# EAGLE design digits (EAGLE 7.7.0)
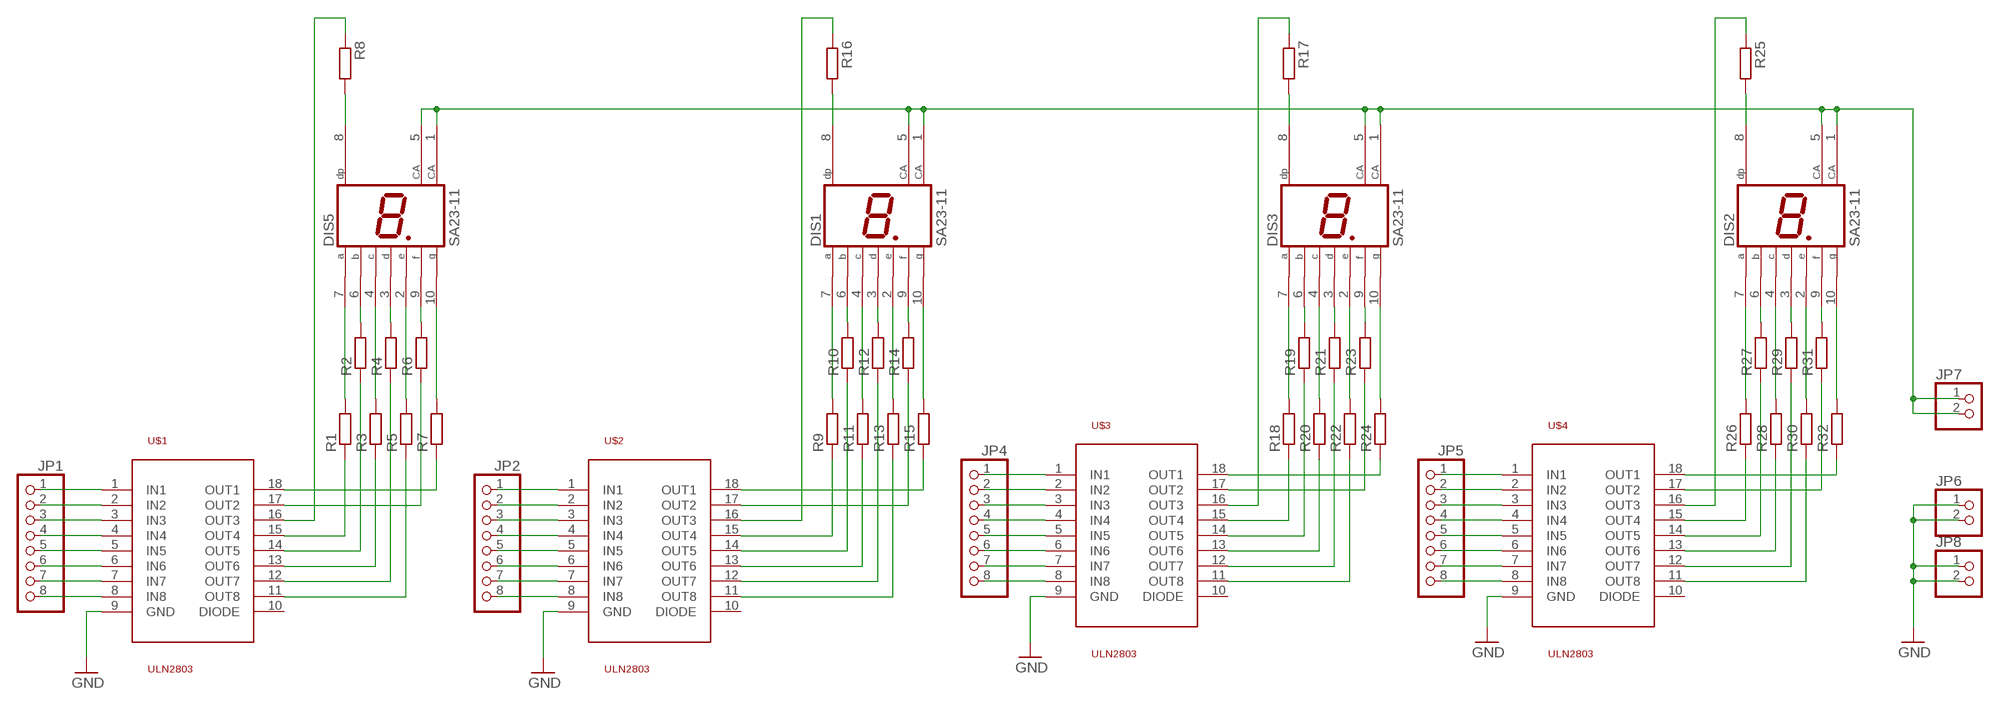
[diagram p0: schematic, sheet 1]

## Parts
DIS1  SA23-11  [SX23-XX]
DIS2  SA23-11  [SX23-XX]
DIS3  SA23-11  [SX23-XX]
DIS5  SA23-11  [SX23-XX]
JP1  PINHD-1X8  [1X08]
JP2  PINHD-1X8  [1X08]
JP4  PINHD-1X8  [1X08]
JP5  PINHD-1X8  [1X08]
JP6  PINHD-1X2  [1X02]
JP7  PINHD-1X2  [1X02]
JP8  PINHD-1X2  [1X02]
R1  R-EU_R0603  [R0603]
R2  R-EU_R0603  [R0603]
R3  R-EU_0204/7  [0204/7]
R4  R-EU_0204/7  [0204/7]
R5  R-EU_0204/7  [0204/7]
R6  R-EU_R0603  [R0603]
R7  R-EU_R0603  [R0603]
R8  R-EU_R0603  [R0603]
R9  R-EU_R0603  [R0603]
R10  R-EU_R0603  [R0603]
R11  R-EU_0204/7  [0204/7]
R12  R-EU_0204/7  [0204/7]
R13  R-EU_0204/7  [0204/7]
R14  R-EU_R0603  [R0603]
R15  R-EU_R0603  [R0603]
R16  R-EU_R0603  [R0603]
R17  R-EU_R0603  [R0603]
R18  R-EU_R0603  [R0603]
R19  R-EU_R0603  [R0603]
R20  R-EU_0204/7  [0204/7]
R21  R-EU_0204/7  [0204/7]
R22  R-EU_0204/7  [0204/7]
R23  R-EU_R0603  [R0603]
R24  R-EU_R0603  [R0603]
R25  R-EU_R0603  [R0603]
R26  R-EU_R0603  [R0603]
R27  R-EU_R0603  [R0603]
R28  R-EU_0204/7  [0204/7]
R29  R-EU_0204/7  [0204/7]
R30  R-EU_0204/7  [0204/7]
R31  R-EU_R0603  [R0603]
R32  R-EU_R0603  [R0603]
U$1  ULN2803  [SO18L]
U$2  ULN2803  [SO18L]
U$3  ULN2803  [SO18L]
U$4  ULN2803  [SO18L]

## Nets
9V: DIS1.1(CA) DIS1.5(CA) DIS2.1(CA) DIS2.5(CA) DIS3.1(CA) DIS3.5(CA) DIS5.1(CA) DIS5.5(CA) JP7.1 JP7.2
GND: JP6.1 JP6.2 JP8.1 JP8.2 U$1.9(GND) U$2.9(GND) U$3.9(GND) U$4.9(GND)
N$1: DIS5.7(A) R1.2
N$2: DIS5.6(B) R2.2
N$3: JP1.8 U$1.8(IN8)
N$4: JP1.7 U$1.7(IN7)
N$5: JP1.6 U$1.6(IN6)
N$6: JP1.1 U$1.1(IN1)
N$7: JP1.2 U$1.2(IN2)
N$8: JP1.3 U$1.3(IN3)
N$9: JP1.4 U$1.4(IN4)
N$10: JP1.5 U$1.5(IN5)
N$11: DIS5.4(C) R3.2
N$12: DIS5.3(D) R4.2
N$13: DIS5.2(E) R5.2
N$14: DIS5.9(F) R6.2
N$15: DIS5.10(G) R7.2
N$16: DIS5.8(DP) R8.2
N$17: DIS1.7(A) R9.2
N$18: DIS1.4(C) R11.2
N$19: DIS1.2(E) R13.2
N$20: DIS1.10(G) R15.2
N$21: DIS1.6(B) R10.2
N$22: DIS1.3(D) R12.2
N$23: DIS1.9(F) R14.2
N$24: DIS1.8(DP) R16.2
N$25: DIS3.8(DP) R17.2
N$26: DIS3.7(A) R18.2
N$27: DIS3.4(C) R20.2
N$28: JP2.3 U$2.3(IN3)
N$29: JP2.2 U$2.2(IN2)
N$30: JP2.1 U$2.1(IN1)
N$31: JP2.4 U$2.4(IN4)
N$32: JP2.5 U$2.5(IN5)
N$33: JP2.6 U$2.6(IN6)
N$34: JP2.7 U$2.7(IN7)
N$35: JP2.8 U$2.8(IN8)
N$36: JP4.1 U$3.1(IN1)
N$37: DIS3.2(E) R22.2
N$38: JP4.2 U$3.2(IN2)
N$39: JP4.3 U$3.3(IN3)
N$40: DIS3.10(G) R24.2
N$41: DIS3.6(B) R19.2
N$42: DIS3.3(D) R21.2
N$43: DIS3.9(F) R23.2
N$44: DIS2.8(DP) R25.2
N$45: DIS2.7(A) R26.2
N$46: DIS2.4(C) R28.2
N$47: DIS2.2(E) R30.2
N$48: JP4.4 U$3.4(IN4)
N$49: JP4.5 U$3.5(IN5)
N$50: JP4.6 U$3.6(IN6)
N$51: JP4.7 U$3.7(IN7)
N$52: JP4.8 U$3.8(IN8)
N$53: DIS2.10(G) R32.2
N$54: DIS2.6(B) R27.2
N$55: DIS2.3(D) R29.2
N$56: DIS2.9(F) R31.2
N$57: R5.1 U$1.11(OUT8)
N$58: R4.1 U$1.12(OUT7)
N$59: R3.1 U$1.13(OUT6)
N$60: R2.1 U$1.14(OUT5)
N$61: JP5.3 U$4.3(IN3)
N$62: JP5.1 U$4.1(IN1)
N$63: JP5.2 U$4.2(IN2)
N$64: JP5.4 U$4.4(IN4)
N$65: JP5.5 U$4.5(IN5)
N$66: JP5.6 U$4.6(IN6)
N$67: JP5.7 U$4.7(IN7)
N$68: JP5.8 U$4.8(IN8)
N$69: R1.1 U$1.15(OUT4)
N$70: R8.1 U$1.16(OUT3)
N$71: R6.1 U$1.17(OUT2)
N$72: R7.1 U$1.18(OUT1)
N$73: R15.1 U$2.18(OUT1)
N$74: R14.1 U$2.17(OUT2)
N$75: R16.1 U$2.16(OUT3)
N$76: R9.1 U$2.15(OUT4)
N$77: R10.1 U$2.14(OUT5)
N$78: R11.1 U$2.13(OUT6)
N$79: R12.1 U$2.12(OUT7)
N$80: R13.1 U$2.11(OUT8)
N$81: R24.1 U$3.18(OUT1)
N$82: R23.1 U$3.17(OUT2)
N$83: R17.1 U$3.16(OUT3)
N$84: R18.1 U$3.15(OUT4)
N$85: R19.1 U$3.14(OUT5)
N$86: R20.1 U$3.13(OUT6)
N$87: R21.1 U$3.12(OUT7)
N$88: R22.1 U$3.11(OUT8)
N$89: R32.1 U$4.18(OUT1)
N$90: R31.1 U$4.17(OUT2)
N$91: R25.1 U$4.16(OUT3)
N$92: R26.1 U$4.15(OUT4)
N$93: R27.1 U$4.14(OUT5)
N$94: R28.1 U$4.13(OUT6)
N$95: R29.1 U$4.12(OUT7)
N$96: R30.1 U$4.11(OUT8)
Unconnected: U$1.10(DIODE) U$2.10(DIODE) U$3.10(DIODE) U$4.10(DIODE)

## Library data of the parts
DIS1-DIS3 DIS5 = display-kingbright:SA23-11: LED DISPLAY 1-character 7 segment, decimal point right
JP1 JP2 JP4 JP5 = pinhead:PINHD-1X8: PIN HEADER
JP6-JP8 = pinhead:PINHD-1X2: PIN HEADER
R1-R32 = rcl:R-EU_: RESISTOR, European symbol
U$1-U$4 = uln2803:ULN2803

## Board
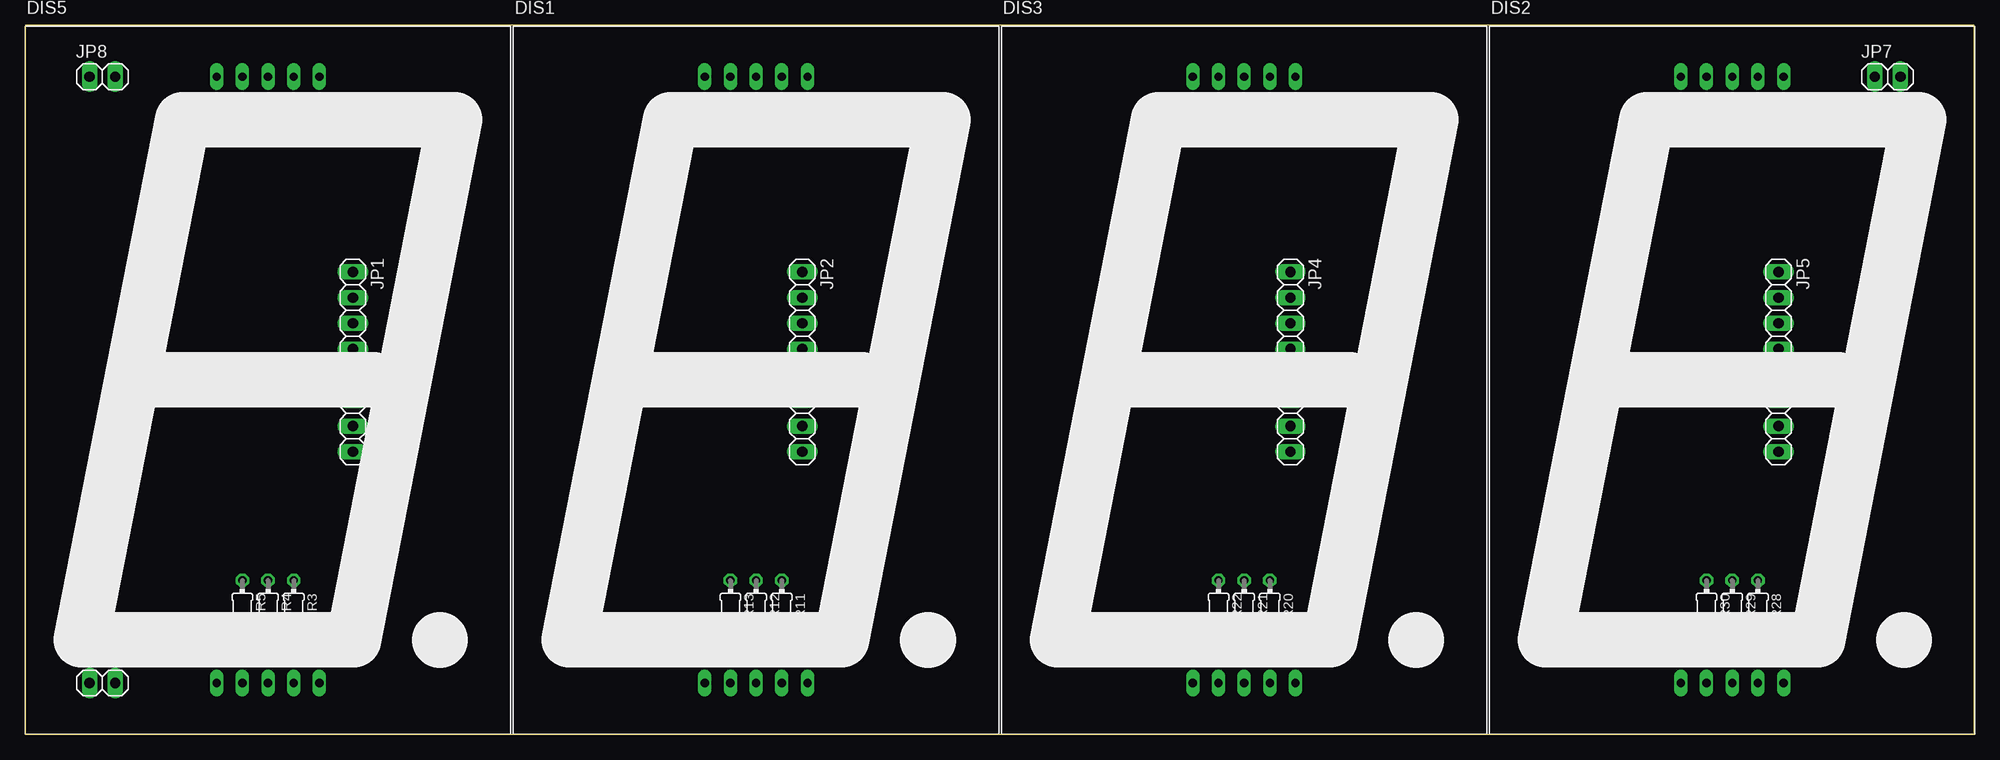
[diagram p1: board, top side]
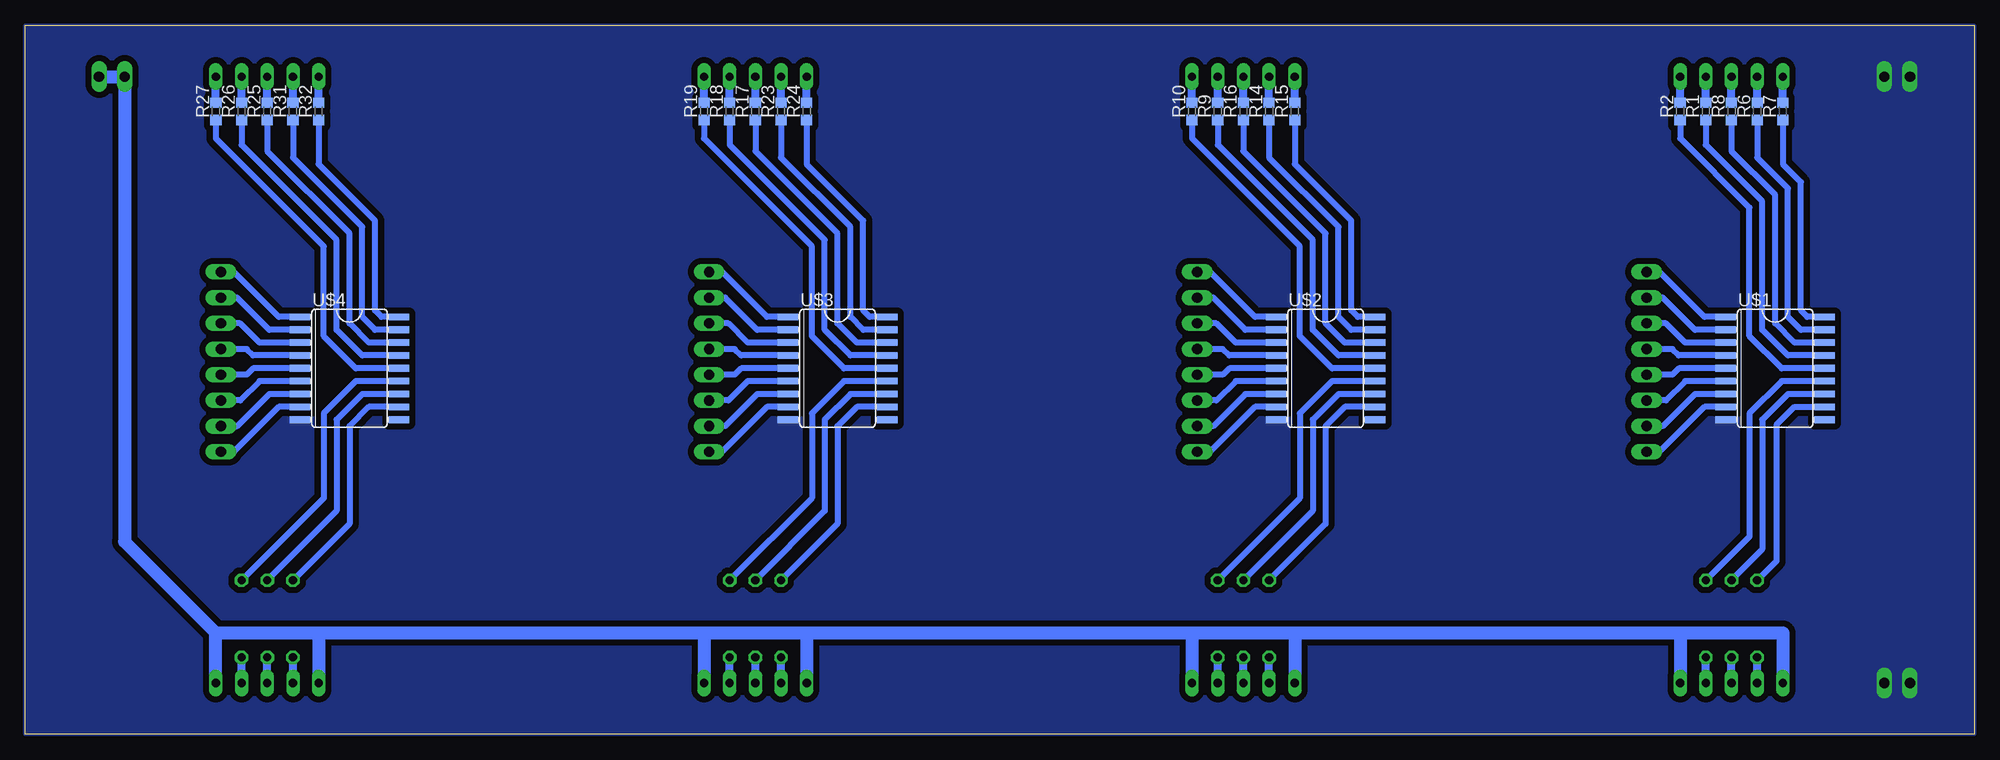
[diagram p2: board, bottom side, seen from below]

Size 192.71 x 70.1 mm. Coordinates in mm from the lower left corner, seen from the top.
Outline: 0,0 192.71,0 192.71,70.1 0,70.1 0,0
Copper layers (1*16): Top 0.035mm / dielectric 1.5mm / Bottom 0.035mm
Design rules "default *": minimum track width 10mil, minimum drill 24mil, track to track 8mil, track to pad 8mil, pad to pad 8mil, via to via 8mil, smd to smd 8mil, copper to edge 0mil, drill to drill 8mil, minimum pad ring 10mil, minimum via ring 8mil, stop-mask expansion 4mil, vias tented up to drill 0mil, thermal gap 10mil

### Footprints (pad centres in the part's own frame; a part is rotated, then mirrored left to right if it is on the bottom)
SX23-XX = drill 0.813 long: 1 18.923,5.08; 2 21.463,5.08; 3 24.003,5.08; 4 26.543,5.08; 5 29.083,5.08; 6 29.083,65.024; 7 26.543,65.024; 8 24.003,65.024; 9 21.463,65.024; 10 18.923,65.024
1X08 = drill 1.016 long: 1 -8.89,0; 2 -6.35,0; 3 -3.81,0; 4 -1.27,0; 5 1.27,0; 6 3.81,0; 7 6.35,0; 8 8.89,0
1X02 = drill 1.016 long: 1 -1.27,0; 2 1.27,0
R0603 = smd 1 x 1.1: 1 -0.85,0; 2 0.85,0
0204/7 = drill 0.813 octagon: 1 -3.81,0; 2 3.81,0
SO18L = smd 0.66 x 2.032: 1 -5.08,-4.902; 2 -3.81,-4.902; 3 -2.54,-4.902; 4 -1.27,-4.902; 5 0,-4.902; 6 1.27,-4.902; 7 2.54,-4.902; 8 3.81,-4.902; 9 5.08,-4.902; 10 5.08,4.902; 11 3.81,4.902; 12 2.54,4.902; 13 1.27,4.902; 14 0,4.902; 15 -1.27,4.902; 16 -2.54,4.902; 17 -3.81,4.902; 18 -5.08,4.902

### Placement (x,y rotation side)
DIS1  48.26,0 0 top
DIS2  144.78,0 0 top
DIS3  96.52,0 0 top
DIS5  0,0 0 top
JP1  32.38,36.83 270 top
JP2  76.83,36.83 270 top
JP4  125.09,36.83 270 top
JP5  173.35,36.83 270 top
JP6  7.62,5.08 0 top
JP7  184.15,65.02 0 top
JP8  7.62,65.02 0 top
R1  26.54,61.59 90 bottom
R2  29.08,61.59 90 bottom
R3  26.54,11.43 270 top
R4  24,11.43 270 top
R5  21.46,11.43 270 top
R6  21.46,61.59 90 bottom
R7  18.92,61.59 90 bottom
R8  24,61.59 90 bottom
R9  74.8,61.59 90 bottom
R10  77.34,61.59 90 bottom
R11  74.8,11.43 270 top
R12  72.26,11.43 270 top
R13  69.72,11.43 270 top
R14  69.72,61.59 90 bottom
R15  67.18,61.59 90 bottom
R16  72.26,61.59 90 bottom
R17  120.52,61.59 90 bottom
R18  123.06,61.59 90 bottom
R19  125.6,61.59 90 bottom
R20  123.06,11.43 270 top
R21  120.52,11.43 270 top
R22  117.98,11.43 270 top
R23  117.98,61.59 90 bottom
R24  115.44,61.59 90 bottom
R25  168.78,61.59 90 bottom
R26  171.32,61.59 90 bottom
R27  173.86,61.59 90 bottom
R28  171.32,11.43 270 top
R29  168.78,11.43 270 top
R30  166.24,11.43 270 top
R31  166.24,61.59 90 bottom
R32  163.7,61.59 90 bottom
U$1  19.68,36.2 270 bottom
U$2  64.14,36.2 270 bottom
U$3  112.39,36.2 270 bottom
U$4  160.66,36.2 270 bottom

### Tracks (layer width: path | path; a pad name or v marks a point on that pad's centre or on a via)
9V
  Bottom 1.27: JP7.2 JP7.1 182.88,19.05 173.86,10.03 | DIS2.5 173.86,10.03 | 173.86,10.03 163.7,10.03 | 163.7,10.03 DIS2.1 | 163.7,10.03 125.6,10.03 | 125.6,10.03 DIS3.5 | 125.6,10.03 115.44,10.03 | 115.44,10.03 DIS3.1 | 115.44,10.03 77.34,10.03 | 77.34,10.03 DIS1.5 | 77.34,10.03 67.18,10.03 | 67.18,10.03 DIS1.1 | 67.18,10.03 29.08,10.03 | 29.08,10.03 DIS5.5 | 29.08,10.03 18.92,10.03 DIS5.1
GND
  pour Bottom (isolate 0.61, no thermals): 0,70.1 0,0 192.71,0 192.71,70.1
N$1
  Bottom 0.813: R1.2 DIS5.7
N$2
  Bottom 0.813: R2.2 DIS5.6
N$3
  Bottom 0.61: U$1.8 26.67,32.38 31.11,27.94 JP1.8
N$4
  Bottom 0.61: U$1.7 27.62,33.66 30.8,30.48 JP1.7
N$5
  Bottom 0.61: U$1.6 28.57,34.92 30.48,33.02 JP1.6
N$6
  Bottom 0.61: U$1.1 26.67,41.27 31.11,45.72 JP1.1
N$7
  Bottom 0.61: U$1.2 27.62,40.01 30.8,43.18 JP1.2
N$8
  Bottom 0.61: U$1.3 28.57,38.73 30.48,40.64 JP1.3
N$9
  Bottom 0.61: U$1.4 29.21,37.47 29.84,38.1 JP1.4
N$10
  Bottom 0.61: U$1.5 29.21,36.2 29.84,35.56 JP1.5
N$11
  Bottom 0.813: DIS5.4 R3.2
N$12
  Bottom 0.813: DIS5.3 R4.2
N$13
  Bottom 0.813: DIS5.2 R5.2
N$14
  Bottom 0.813: R6.2 DIS5.9
N$15
  Bottom 0.813: R7.2 DIS5.10
N$16
  Bottom 0.813: R8.2 DIS5.8
N$17
  Bottom 0.813: R9.2 DIS1.7
N$18
  Bottom 0.813: DIS1.4 R11.2
N$19
  Bottom 0.813: DIS1.2 R13.2
N$20
  Bottom 0.813: R15.2 DIS1.10
N$21
  Bottom 0.813: R10.2 DIS1.6
N$22
  Bottom 0.813: DIS1.3 R12.2
N$23
  Bottom 0.813: R14.2 DIS1.9
N$24
  Bottom 0.813: R16.2 DIS1.8
N$25
  Bottom 0.813: R17.2 DIS3.8
N$26
  Bottom 0.813: R18.2 DIS3.7
N$27
  Bottom 0.813: DIS3.4 R20.2
N$28
  Bottom 0.61: U$2.3 73.03,38.73 74.93,40.64 JP2.3
N$29
  Bottom 0.61: U$2.2 72.07,40.01 75.25,43.18 JP2.2
N$30
  Bottom 0.61: U$2.1 71.12,41.27 75.56,45.72 JP2.1
N$31
  Bottom 0.61: U$2.4 73.66,37.47 74.3,38.1 JP2.4
N$32
  Bottom 0.61: U$2.5 73.66,36.2 74.3,35.56 JP2.5
N$33
  Bottom 0.61: U$2.6 73.03,34.92 74.93,33.02 JP2.6
N$34
  Bottom 0.61: U$2.7 72.07,33.66 75.25,30.48 JP2.7
N$35
  Bottom 0.61: U$2.8 71.12,32.38 75.56,27.94 JP2.8
N$36
  Bottom 0.61: U$3.1 119.38,41.27 123.83,45.72 JP4.1
N$37
  Bottom 0.813: DIS3.2 R22.2
N$38
  Bottom 0.61: U$3.2 120.33,40.01 123.51,43.18 JP4.2
N$39
  Bottom 0.61: U$3.3 121.28,38.73 123.19,40.64 JP4.3
N$40
  Bottom 0.813: R24.2 DIS3.10
N$41
  Bottom 0.813: R19.2 DIS3.6
N$42
  Bottom 0.813: DIS3.3 R21.2
N$43
  Bottom 0.813: R23.2 DIS3.9
N$44
  Bottom 0.813: R25.2 DIS2.8
N$45
  Bottom 0.813: R26.2 DIS2.7
N$46
  Bottom 0.813: DIS2.4 R28.2
N$47
  Bottom 0.813: DIS2.2 R30.2
N$48
  Bottom 0.61: U$3.4 121.92,37.47 122.56,38.1 JP4.4
N$49
  Bottom 0.61: U$3.5 121.92,36.2 122.56,35.56 JP4.5
N$50
  Bottom 0.61: U$3.6 121.28,34.92 123.19,33.02 JP4.6
N$51
  Bottom 0.61: U$3.7 120.33,33.66 123.51,30.48 JP4.7
N$52
  Bottom 0.61: U$3.8 119.38,32.38 123.83,27.94 JP4.8
N$53
  Bottom 0.813: R32.2 DIS2.10
N$54
  Bottom 0.813: R27.2 DIS2.6
N$55
  Bottom 0.813: DIS2.3 R29.2
N$56
  Bottom 0.813: R31.2 DIS2.9
N$57
  Bottom 0.61: U$1.11 17.78,32.38 19.56,30.61 19.56,17.14 R5.1
N$58
  Bottom 0.61: U$1.12 18.41,33.66 20.95,31.11 20.95,18.29 R4.1
N$59
  Bottom 0.61: U$1.13 19.05,34.92 22.23,31.75 22.23,19.56 R3.1
N$60
  Bottom 0.61: U$1.14 19.05,36.2 22.23,39.37 22.23,52.07 29.08,58.93 R2.1
N$61
  Bottom 0.61: U$4.3 169.54,38.73 171.45,40.64 JP5.3
N$62
  Bottom 0.61: U$4.1 167.64,41.27 172.09,45.72 JP5.1
N$63
  Bottom 0.61: U$4.2 168.59,40.01 171.77,43.18 JP5.2
N$64
  Bottom 0.61: U$4.4 170.18,37.47 170.81,38.1 JP5.4
N$65
  Bottom 0.61: U$4.5 170.18,36.2 170.81,35.56 JP5.5
N$66
  Bottom 0.61: U$4.6 169.54,34.92 171.45,33.02 JP5.6
N$67
  Bottom 0.61: U$4.7 168.59,33.66 171.77,30.48 JP5.7
N$68
  Bottom 0.61: U$4.8 167.64,32.38 172.09,27.94 JP5.8
N$69
  Bottom 0.61: U$1.15 18.41,37.47 20.95,40.01 20.95,52.7 26.54,58.29 R1.1
N$70
  Bottom 0.61: U$1.16 17.78,38.73 19.68,40.64 19.68,53.34 24,57.66 R8.1
N$71
  Bottom 0.61: U$1.17 17.14,40.01 18.41,41.27 18.41,53.98 21.46,57.02 R6.1
N$72
  Bottom 0.61: U$1.18 16.51,41.27 17.14,41.91 17.14,54.61 18.92,56.39 R7.1
N$73
  Bottom 0.61: U$2.18 60.96,41.27 61.59,41.91 61.59,50.8 67.18,56.39 R15.1
N$74
  Bottom 0.61: U$2.17 61.59,40.01 62.87,41.27 62.87,50.16 69.72,57.02 R14.1
N$75
  Bottom 0.61: U$2.16 62.23,38.73 64.14,40.64 64.14,49.53 72.26,57.66 R16.1
N$76
  Bottom 0.61: U$2.15 62.87,37.47 65.41,40.01 65.41,48.9 74.8,58.29 R9.1
N$77
  Bottom 0.61: U$2.14 63.5,36.2 66.67,39.37 66.67,48.26 77.34,58.93 R10.1
N$78
  Bottom 0.61: U$2.13 63.5,34.92 66.67,31.75 66.67,23.37 R11.1
N$79
  Bottom 0.61: U$2.12 62.87,33.66 65.41,31.11 65.41,22.1 R12.1
N$80
  Bottom 0.61: U$2.11 62.23,32.38 64.14,30.48 64.14,20.83 R13.1
N$81
  Bottom 0.61: U$3.18 109.22,41.27 109.86,41.91 109.86,50.8 115.44,56.39 R24.1
N$82
  Bottom 0.61: U$3.17 109.86,40.01 111.12,41.27 111.12,50.16 117.98,57.02 R23.1
N$83
  Bottom 0.61: U$3.16 110.49,38.73 112.39,40.64 112.39,49.53 120.52,57.66 R17.1
N$84
  Bottom 0.61: U$3.15 111.12,37.47 113.67,40.01 113.67,48.9 123.06,58.29 R18.1
N$85
  Bottom 0.61: U$3.14 111.76,36.2 114.94,39.37 114.94,48.26 125.6,58.93 R19.1
N$86
  Bottom 0.61: U$3.13 111.76,34.92 114.94,31.75 114.94,23.37 R20.1
N$87
  Bottom 0.61: U$3.12 111.12,33.66 113.67,31.11 113.67,22.1 R21.1
N$88
  Bottom 0.61: U$3.11 110.49,32.38 112.39,30.48 112.39,20.83 R22.1
N$89
  Bottom 0.61: U$4.18 157.48,41.27 158.12,41.91 158.12,50.8 163.7,56.39 R32.1
N$90
  Bottom 0.61: U$4.17 158.12,40.01 159.38,41.27 159.38,50.16 166.24,57.02 R31.1
N$91
  Bottom 0.61: U$4.16 158.75,38.73 160.66,40.64 160.66,49.53 168.78,57.66 R25.1
N$92
  Bottom 0.61: U$4.15 159.38,37.47 161.93,40.01 161.93,48.9 171.32,58.29 R26.1
N$93
  Bottom 0.61: U$4.14 160.02,36.2 163.19,39.37 163.19,48.26 173.86,58.93 R27.1
N$94
  Bottom 0.61: U$4.13 160.02,34.92 163.19,31.75 163.19,23.37 R28.1
N$95
  Bottom 0.61: U$4.12 159.38,33.66 161.93,31.11 161.93,22.1 R29.1
N$96
  Bottom 0.61: U$4.11 158.75,32.38 160.66,30.48 160.66,20.83 R30.1